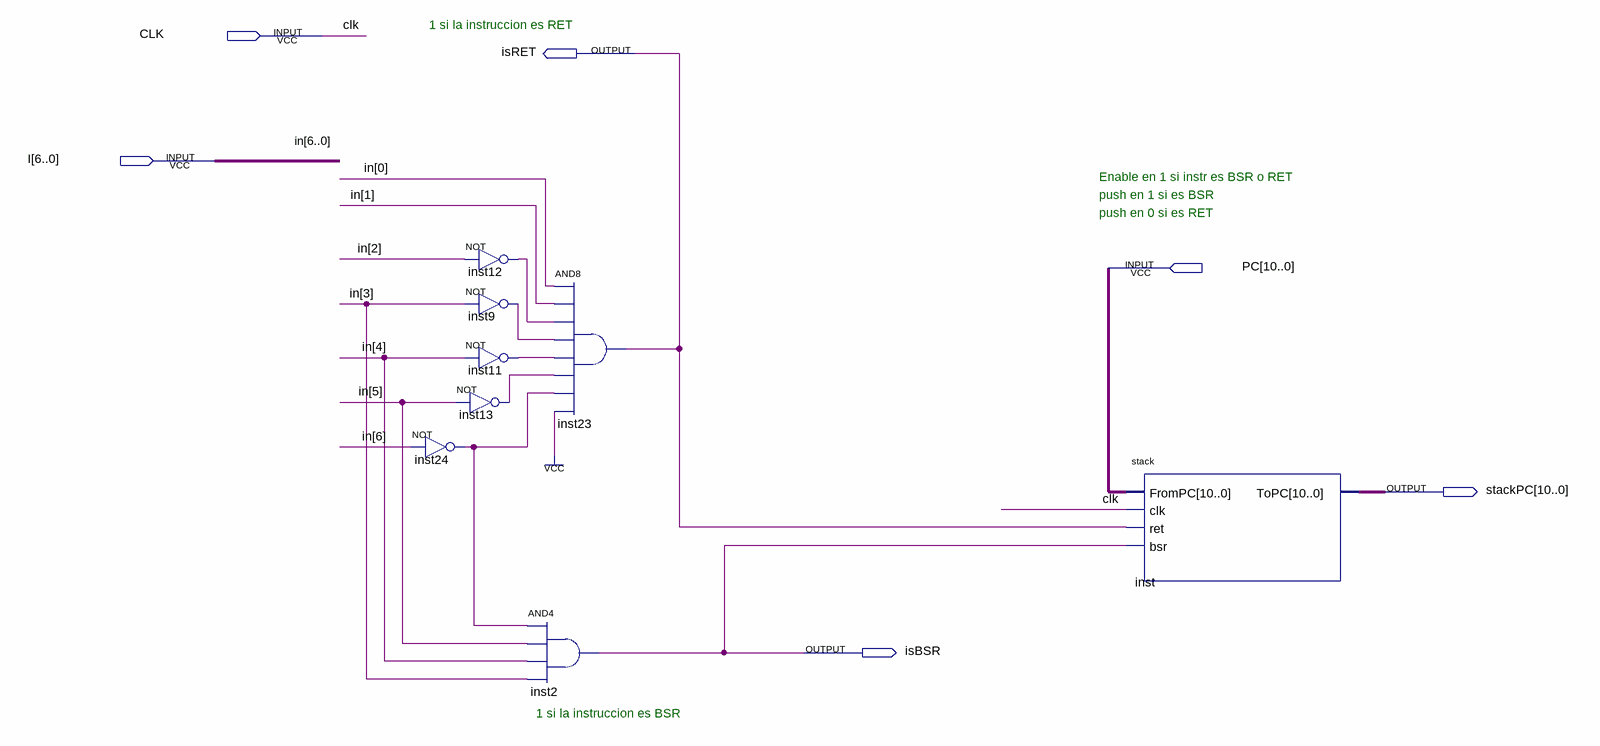
[diagram p0: schematic sheet]
// Quartus schematic SubRoutineControlUnit.bdf as structural Verilog: 8 symbols, 6 pins
module SubRoutineControlUnit (
  input  CLK,
  input  [6:0] I,
  input  [10:0] PC,
  output isRET,
  output [10:0] stackPC,
  output isBSR
);

  wire inst9_out, inst11_out, inst12_out, inst13_out, inst24_out;

  not inst24 (inst24_out, I[6]);
  not inst12 (inst12_out, I[2]);
  not inst9 (inst9_out, I[3]);
  not inst11 (inst11_out, I[4]);
  not inst13 (inst13_out, I[5]);
  and inst23 (isRET, I[0], I[1], inst12_out, inst9_out, inst11_out, inst13_out, inst24_out, 1'b1);
  and inst2 (isBSR, inst24_out, I[5], I[4], I[3]);
  stack inst (.FromPC(PC), .clk(CLK), .ret(isRET), .bsr(isBSR), .ToPC(stackPC));

  // Other names for the same wires on the sheet: in[6:0] = I

  // Notes on the sheet:
  //   1 si la instruccion es RET
  //   Enable en 1 si instr es BSR o RET
  //   push en 1 si es BSR
  //   push en 0 si es RET
  //   1 si la instruccion es BSR
endmodule
